# EasyEDA schematic Pratica 02.json
TITLE: Sheet_1; REV: 1.0; Date: 2021-07-30; Sheet: 1/1; Drawn By: Davi de Pontes Pasquini; Company: Your Company
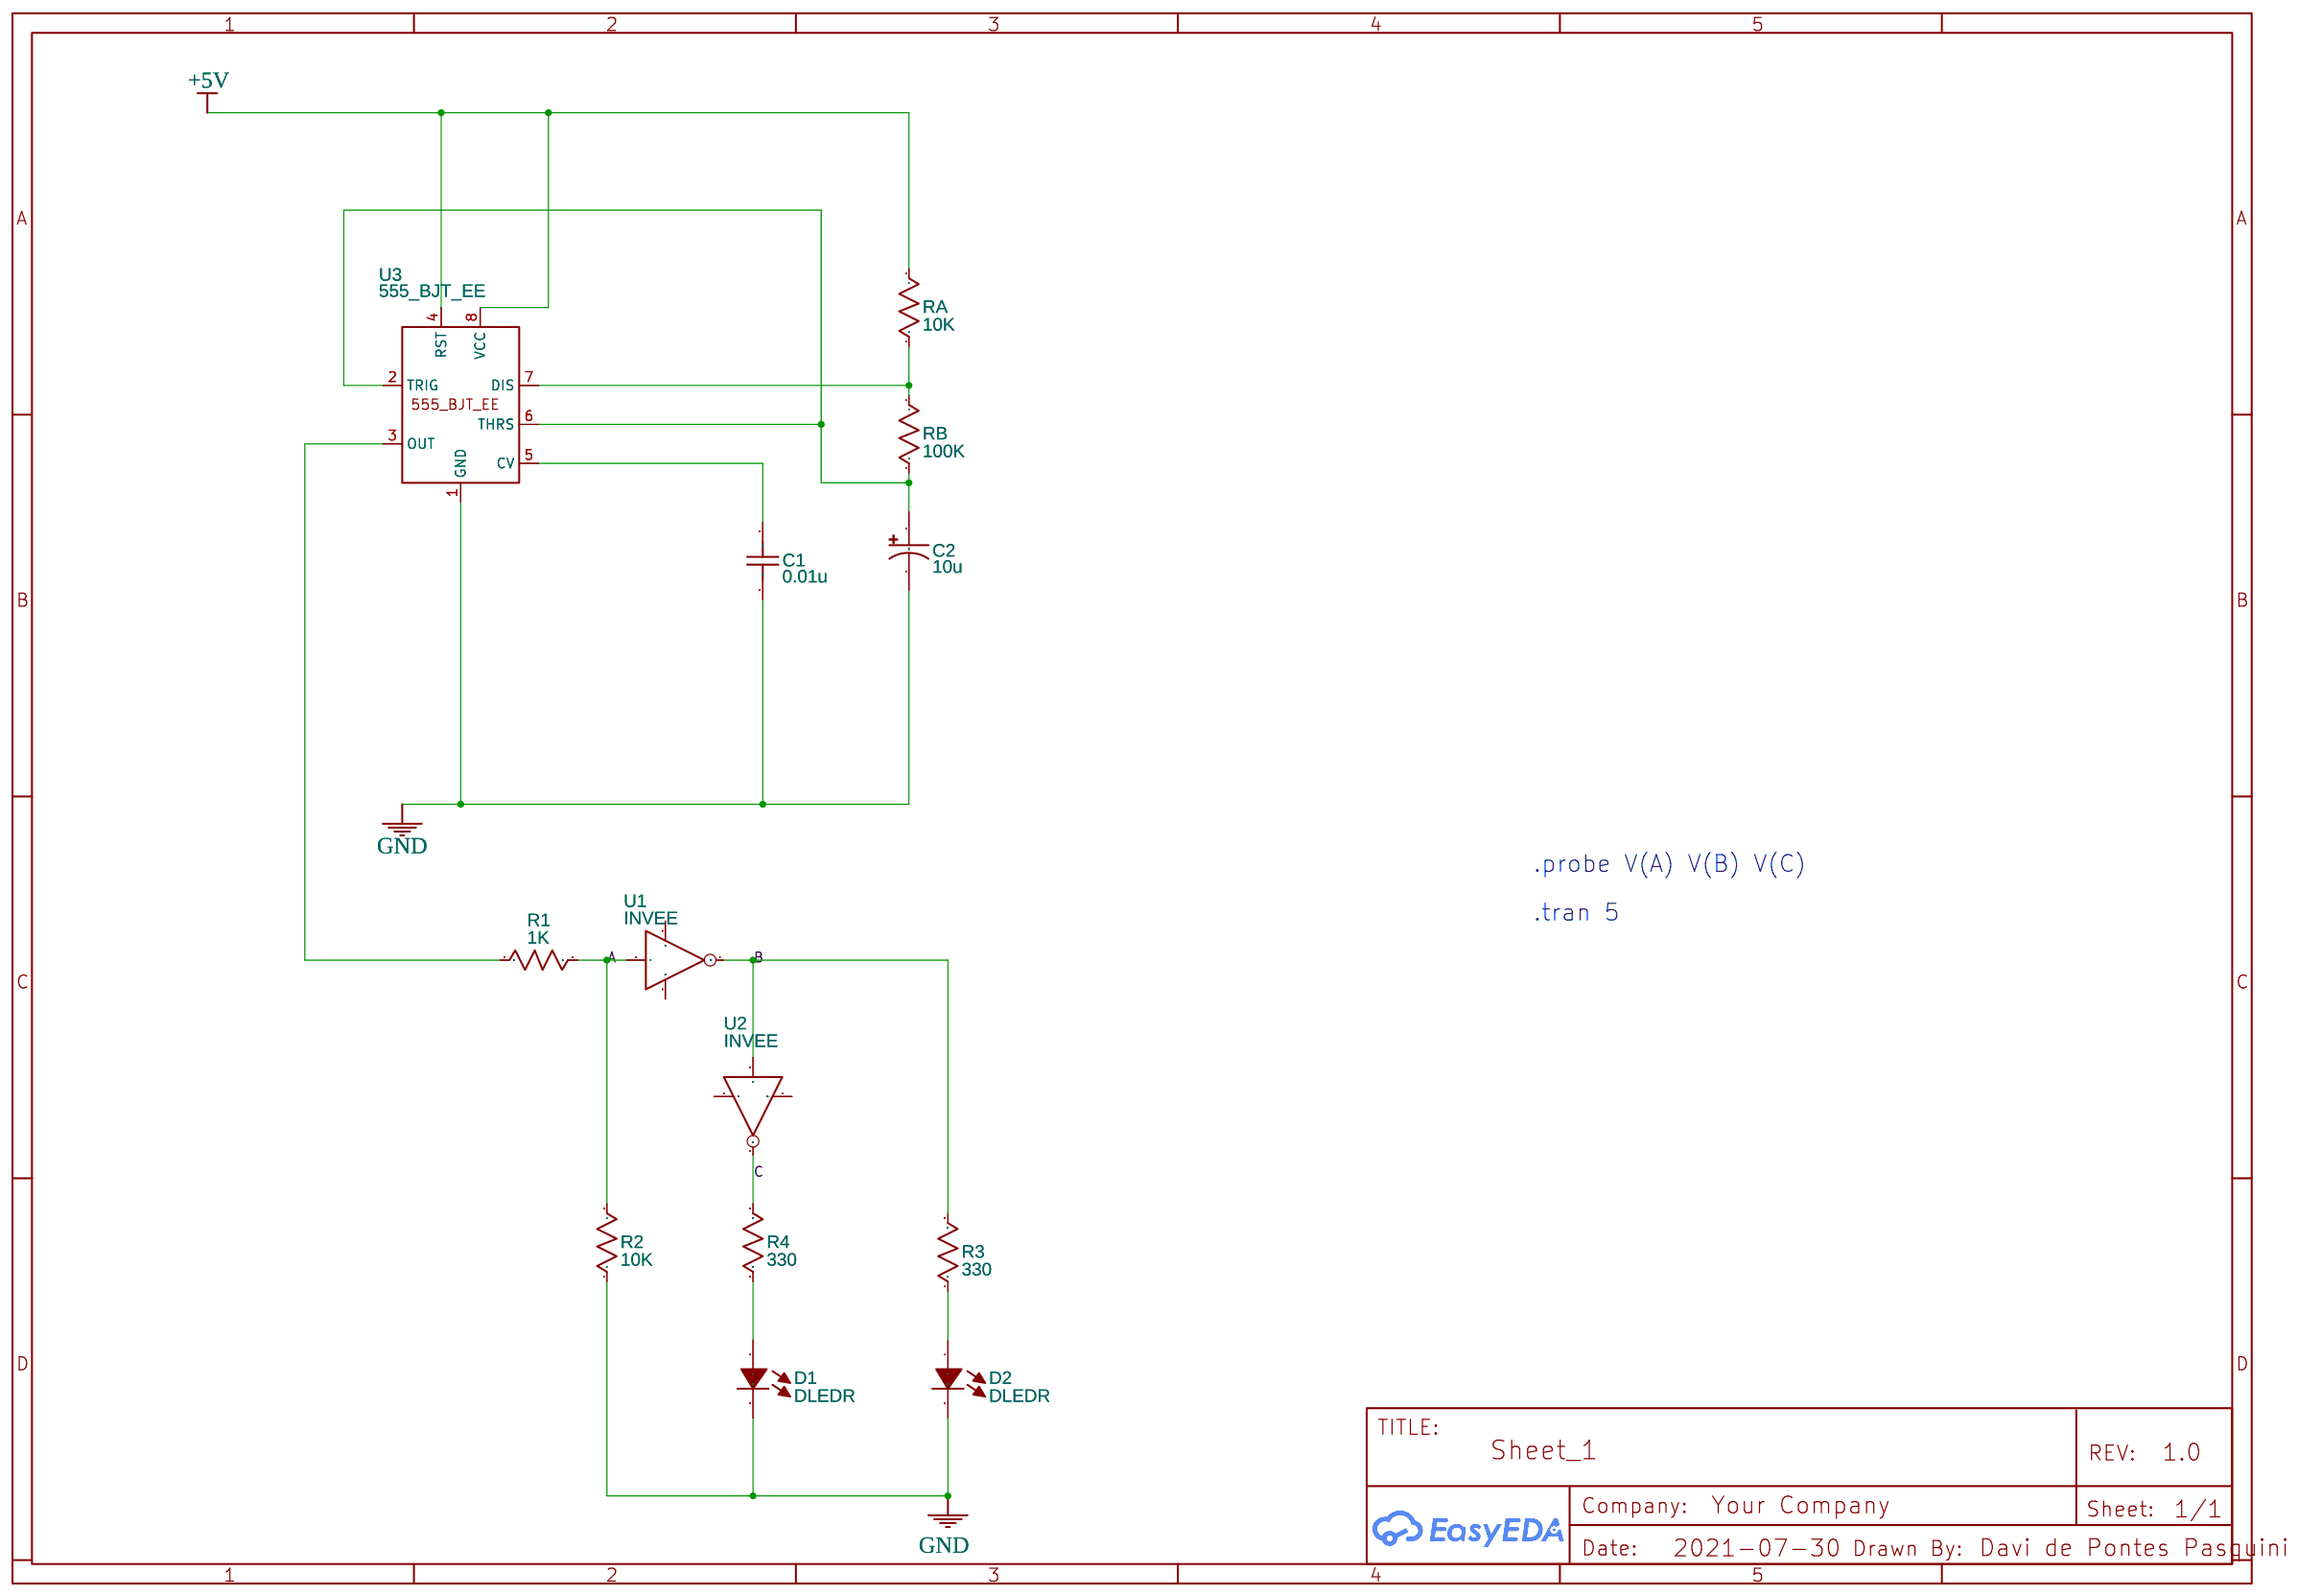
[diagram p0: schematic sheet]

## Parts
C1  0.01u  [RAD-0.1]
C2  10u  [CAP-D3.0XF1.5]
D1  DLEDR  [LED3MM]
D2  DLEDR  [LED3MM]
R1  1K  [AXIAL-0.3]
R2  10K  [AXIAL-0.3]
R3  330  [AXIAL-0.3]
R4  330  [AXIAL-0.3]
RA  10K  [AXIAL-0.3]
RB  100K  [AXIAL-0.3]
U1  INVEE
U2  INVEE
U3  555_BJT_EE  [DIP8]

## Library data of the parts
C1 = Capacitor_US: Contributor: EasyEDA; Supplier: YUJING; Capacitance: 1u
C2 = Capacitor_Electrolytic_US: Supplier: YUJING; Contributor: EasyEDA; Capacitance: 1u
D1 D2 = DLEDR: sourceId: 39lVhsq0A; sim: true
R1-R4 RA RB = Resistor_US: Resistance: 1k; Contributor: EasyEDA; Supplier: YUJING
U1 U2 = LOGIC: Contributor: EasyEDA
U3 = 555_BJT_EE: Contributor: EasyEDA; link: http://www.ti.com/lit/ds/symlink/ne555.pdf

## Nets
+5V: RA.1 U3.4(RST) U3.8(VCC)
GND: C1.1 C2.2 D1.2(C) D2.2(C) R2.1 U3.1(GND)
A: R1.2 R2.2 U1.1(IN)
B: R3.2 U1.4(OUT) U2.1(IN)
C: R4.2 U2.4(OUT)
Net-(C1-2): C1.2 U3.5(CV)
Net-(C2-1): C2.1 RB.2 U3.2(TRIG) U3.6(THRS)
Net-(D1-1): D1.1(A) R4.1
Net-(D2-1): D2.1(A) R3.1
Net-(R1-1): R1.1 U3.3(OUT)
Net-(RA-2): RA.2 RB.1 U3.7(DIS)

Not connected (* = marked no-connect by the designer): U1 2(VDD) 3(GND); U2 2(VDD) 3(GND)

## Notes on the sheet
- .probe V(A) V(B) V(C)
- .tran 5
